# Altium project LCDThermostat.PrjPCB
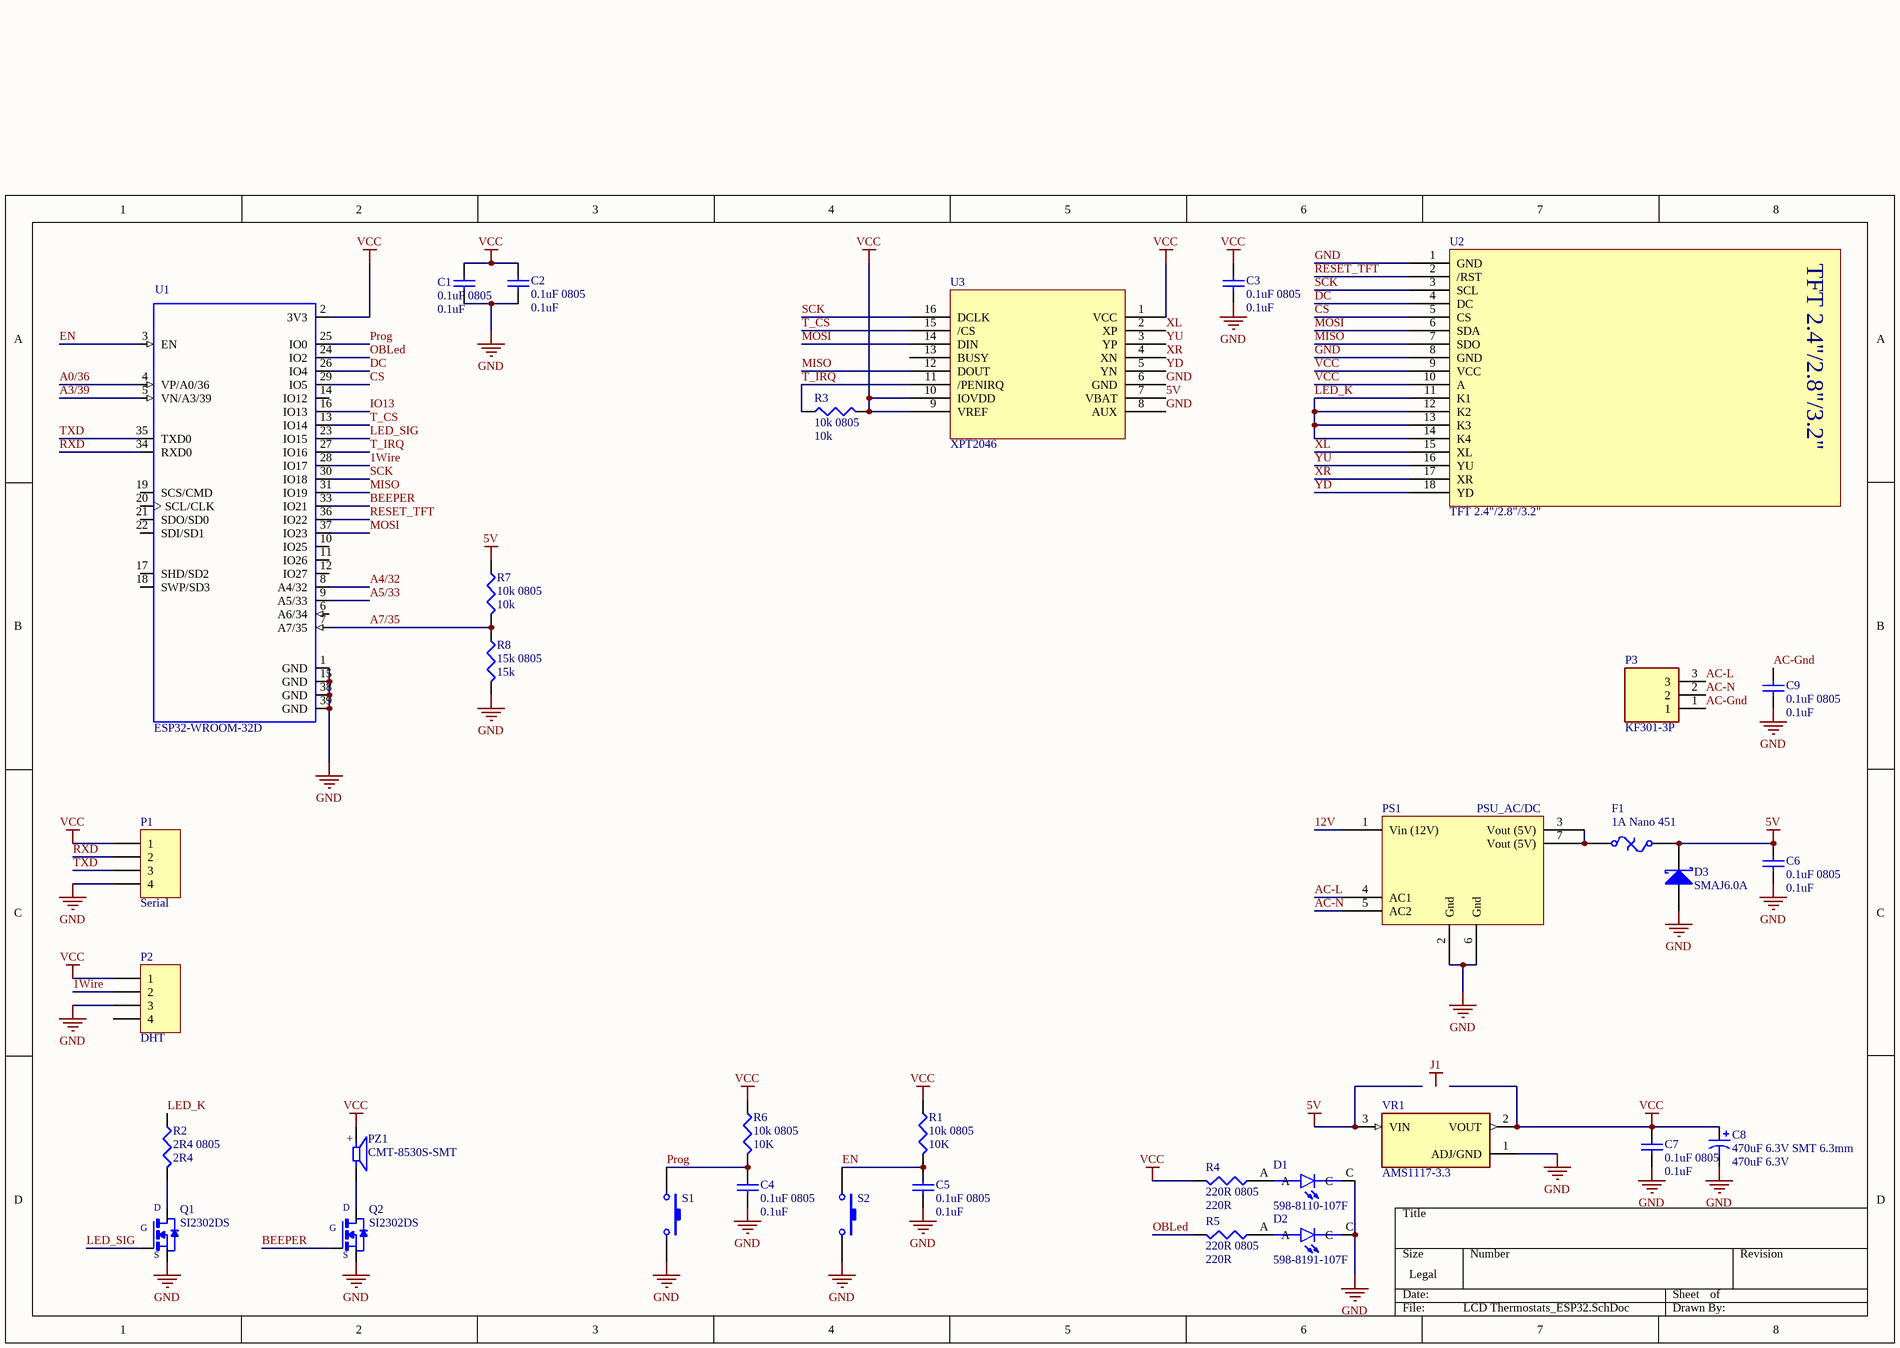
[diagram p0: LCD Thermostats_ESP32.SchDoc]
1 sheet, 34 parts. Net scope: global (net labels, ports and power ports of the same name join across sheets).
Board file: LCD Thermostats_ESP32.PcbDoc

## Sheet LCD Thermostats_ESP32.SchDoc
size Legal

### Parts
C1  0.1uF 0805  value 0.1uF  [C0805_3D]
C2  0.1uF 0805  value 0.1uF  [C0805_3D]
C3  0.1uF 0805  value 0.1uF  [C0805_3D]
C4  0.1uF 0805  value 0.1uF  [C0805_3D]
C5  0.1uF 0805  value 0.1uF  [C0805_3D]
C6  0.1uF 0805  value 0.1uF  [C0805_3D]
C7  0.1uF 0805  value 0.1uF  [C0805_3D]
C8  470uF 6.3V SMT 6.3mm  value 470uF 6.3V  [CAP_SMT_6.3mm]
C9  0.1uF 0805  value 0.1uF  [C0805_3D]
D1  598-8110-107F  [LEDC2012X70N]
D2  598-8191-107F  [LEDC2012X70N]
D3  SMAJ6.0A  [DO214ac]
F1  1A Nano 451  [451 fuse]
P1  Serial  [HDR1X4]
P2  DHT  [HDR1X4]
P3  KF301-3P  [KF3013P]
PS1  PSU_AC/DC  [PSU_AC/DC]
PZ1  CMT-8530S-SMT  [CUI_CMT-8530S-SMT]
Q1  SI2302DS  [SOT23]
Q2  SI2302DS  [SOT23]
R1  10k 0805  value 10K  [R0805_3D]
R2  2R4 0805  value 2R4  [R0805_3D]
R3  10k 0805  value 10k  [R0805_3D]
R4  220R 0805  value 220R  [R0805_3D]
R5  220R 0805  value 220R  [R0805_3D]
R6  10k 0805  value 10K  [R0805_3D]
R7  10k 0805  value 10k  [R0805_3D]
R8  15k 0805  value 15k  [R0805_3D]
S1  SW-PB  [PB_SW_SMT2]  (value not drawn)
S2  SW-PB  [PB_SW_SMT2]  (value not drawn)
U1  ESP32-WROOM-32D  [*MODULE_ESP32-WROOM-32D]
U2  TFT 2.4"/2.8"/3.2"  [TFT_2.4"]
U3  XPT2046  [TSSOP-16]
VR1  AMS1117-3.3  [SOT-223]

### Nets
5V: C6.2 D3.2(K) F1.2 R7.1 U3.7(VBAT) VR1.3(VIN)
GND: C1.1 C2.1 C3.1 C4.1 C5.1 C6.1 C7.1 C8.2 C9.1 D1.C D2.C D3.1(A) P1.4 P2.3 PS1.2(Gnd) PS1.6(Gnd) Q1.2(S) Q2.2(S) R8.2 S1.2 S2.2 U1.1(GND) U1.15(GND) U1.38(GND) U1.39(GND) U2.1(GND) U2.8(GND) U3.6(GND) U3.8(AUX) VR1.1(ADJ/GND)
VCC: C1.2 C2.2 C3.2 C7.2 C8.1 P1.1 P2.1 PZ1.P R1.1 R3.2 R4.2 R6.1 U1.2(3V3) U2.9(VCC) U2.10(A) U3.1(VCC) U3.9(VREF) U3.10(IOVDD) VR1.2(VOUT) VR1.4(VOUT)
1Wire: P2.2 U1.28(IO17)
12V: PS1.1(Vin_(12V))
A0/36: U1.4(VP/A0/36)
A3/39: U1.5(VN/A3/39)
A4/32: U1.8(A4/32)
A5/33: U1.9(A5/33)
A7/35: R7.2 R8.1 U1.7(A7/35)
AC-Gnd: C9.2 P3.1
AC-L: P3.3 PS1.4(AC1)
AC-N: P3.2 PS1.5(AC2)
BEEPER: Q2.1(G) U1.33(IO21)
CS: U1.29(IO5) U2.5(CS)
DC: U1.26(IO4) U2.4(DC)
EN: C5.2 R1.2 S2.1 U1.3(EN)
IO13: U1.16(IO13)
LED_K: R2.1 U2.11(K1) U2.12(K2) U2.13(K3) U2.14(K4)
LED_SIG: Q1.1(G) U1.23(IO15)
MISO: U1.31(IO19) U2.7(SDO) U3.12(DOUT)
MOSI: U1.37(IO23) U2.6(SDA) U3.14(DIN)
OBLed: R5.2 U1.24(IO2)
Prog: C4.2 R6.2 S1.1 U1.25(IO0)
RESET_TFT: U1.36(IO22) U2.2(/RST)
RXD: P1.2 U1.34(RXD0)
SCK: U1.30(IO18) U2.3(SCL) U3.16(DCLK)
T_CS: U1.13(IO14) U3.15(/CS)
T_IRQ: R3.1 U1.27(IO16) U3.11(/PENIRQ)
TXD: P1.3 U1.35(TXD0)
XL: U2.15(XL) U3.2(XP)
XR: U2.17(XR) U3.4(XN)
YD: U2.18(YD) U3.5(YN)
YU: U2.16(YU) U3.3(YP)
NetD1_A: D1.A R4.1
NetD2_A: D2.A R5.1
NetF1_1: F1.1 PS1.3(Vout_(5V)) PS1.7(Vout_(5V))
NetPZ1_N: PZ1.N Q2.3(D)
NetQ1_3: Q1.3(D) R2.2

Not connected (* = marked no-connect by the designer): P2 4; U1 6(A6/34) 10(IO25) 11(IO26) 12(IO27) 14(IO12) 17(SHD/SD2) 18(SWP/SD3) 19(SCS/CMD) 20(SCL/CLK) 21(SDO/SD0) 22(SDI/SD1); U3 13(BUSY)

### Notes on the sheet
- Labels drawn without touching a wire or pin: J1
- (in symbol CMT-8530S-SMT) +

### Library data of the parts
C1-C7 C9 = Cap: Capacitor; Published: 8-Jun-2000; LatestRevisionDate: 17-Jul-2002; LatestRevisionNote: Re-released for DXP Platform.; PackageReference: RAD-0.3; Publisher: Altium Limited; PackageDescription: Radial Cap, Thru-Hole; 2 Leads; 0.3 in Pin Spacing
C8 = Cap Pol3: Polarized Capacitor (Surface Mount); Published: 8-Jun-2000; LatestRevisionDate: 29-May-2009; LatestRevisionNote: IPC-7351 Footprint Added.; PackageReference: C0805; Publisher: Altium Limited; PackageDescription: Chip Capacitor
D1 = 598-8191-107F: Red 635nm LED Indication - Discrete 3.2V 0805 _2012 Metric_; MF: Dialight; Package: 0805 Dialight; Value: *; Availability: Unavailable; MP: 598-8191-107F; SnapEDA_Link: https://www.snapeda.com/parts/598-8191-107F/Dialight/view-part/432480/?ref=snap; Price: None
D2 = 598-8191-107F: Blue 473nm LED Indication - Discrete 3.2V 0805 _2012 Metric_; MF: Dialight; Package: 0805 Dialight; Value: *; Availability: Unavailable; MP: 598-8191-107F; SnapEDA_Link: https://www.snapeda.com/parts/598-8191-107F/Dialight/view-part/432480/?ref=snap; Price: None
D3 = Diode 11DQ03: Schottky Rectifier; pin to pad: 1>A 2>K; Published: 8-Jun-2000; LatestRevisionDate: 17-Jul-2002; LatestRevisionNote: Re-released for DXP Platform.; DatasheetVersion: Dec-1997; PackageReference: DO-204AL; Publisher: Altium Limited; PackageDescription: Diode, Axial; Body 5.2 x 2.7 mm (LxDia. max), Lead Dia. 0.86 mm (max); Code_JEDEC: DO-204-AL; ComponentLink1Description: Manufacturer Link; ComponentLink1URL: http://www.irf.com/; ComponentLink2Description: Datasheet; ComponentLink2URL: http://www.irf.com/product-info/datasheets/data/11dq03.pdf
F1 = Fuse Thermal: 1A Nano 451 SMD 6.1x2.69mm; Published: 24-Mar-1999; LatestRevisionDate: 17-Jul-2002; LatestRevisionNote: Re-released for DXP Platform.; PackageReference: PIN-W2/E2.8; Publisher: Altium Limited; PackageDescription: Thru-Hole; 2 Leads
P1 P2 = Header 4: Header, 4-Pin; LatestRevisionDate: 17-Jul-2002; LatestRevisionNote: Re-released for DXP Platform.; Publisher: Altium Limited
P3 = TB001-500-03BE: 2~24 Poles, Screw Type, Horizontal, 5.0 Pitch, 22~12 (AWG), Terminal Block Connector; MF: CUI Devices; CUI_purchase_URL: https://www.cuidevices.com/product/interconnect/connectors/terminal-blocks/tb001-500-series?utm_source=snapeda.com&utm_medium=referral&utm_campaign=snapedaBOM; Price: None; SnapEDA_Link: https://www.snapeda.com/parts/TB001-500-03BE/CUI%20Devices/view-part/3590297/?ref=snap; Arrow_Electronics-Purchase-URL: https://snapeda.com/shop?store=Arrow+Electronics&id=3590297; Mouser-Purchase-URL: https://snapeda.com/shop?store=Mouser&id=3590297; MP: TB001-500-03BE; Value: *; Availability: Unavailable; DigiKey-Purchase-URL: https://snapeda.com/shop?store=DigiKey&id=3590297; Package: None
PZ1 = CMT-8530S-SMT: 8.5 mm, 3.6 Vo-p, 90 dB, Surface Mount _SMT_, Magnetic Audio Transducer Buzzer; MP: CMT-8530S-SMT-TR; MF: CUI Devices; Availability: Unavailable; SnapEDA_Link: https://www.snapeda.com/parts/CMT-8530S-SMT-TR/CUI%20Devices/view-part/649163/?ref=snap; CUI_purchase_URL: https://www.cuidevices.com/product/audio/buzzers/audio-transducers/cmt-8530s-smt-tr?utm_source=snapeda.com&utm_medium=referral&utm_campaign=snapedaBOM; Package: CUI; Price: None; Value: *
Q1 Q2 = SI2302DS: N-Channel 20V 2.5A _Tc_ 830mW _Tc_ Surface Mount TO-236AB _SOT23_; MF: NXP USA; Availability: Unavailable; Value: *; Price: None; SnapEDA_Link: https://www.snapeda.com/parts/SI2302DS/NXP%20USA%20Inc./view-part/767383/?ref=snap; MP: SI2302DS; Package: SOT-23-3 NXP USA
R1-R8 = Res3: Resistor; Published: 8-Jun-2000; LatestRevisionDate: 29-May-2009; LatestRevisionNote: IPC-7351 Footprint Added.; PackageReference: J1-0603; Publisher: Altium Limited; PackageDescription: Chip Resistor
S1 S2 = SW-PB: Switch; Published: 24-Mar-1999; LatestRevisionDate: 17-Jul-2002; LatestRevisionNote: Re-released for DXP Platform.; PackageReference: SPST-2; Publisher: Altium Limited; PackageDescription: Switch; 2 Leads
U1 = ESP32-WROOM-32D: IC: SoC; GPIO, I2C, I2S, IR, SD, SDIO, SPI, UART; 2.7÷3.6VDC; 20dBm; MF: Espressif Systems; SnapEDA_Link: https://www.snapeda.com/parts/ESP32-WROOM-32D/Espressif%20Systems/view-part/?ref=snap; Package: Module Espressif Systems; MP: ESP32-WROOM-32D; Availability: Unavailable; Price: None; Value: *
VR1 = AMS1117-3.3: Sot223/Pkg 1-Amp 3.3-Volt Low Drop Out Voltage Regulatator; MF: Advanced Monolithic Systems; Price: None; Package: None; Value: *; MP: AMS1117-3.3; Availability: Unavailable; SnapEDA_Link: https://www.snapeda.com/parts/AMS1117-3.3/Advanced%20Monolithic%20Systems/view-part/53450/?ref=snap